# Altium project Dozimetr v1.0.PrjPcb
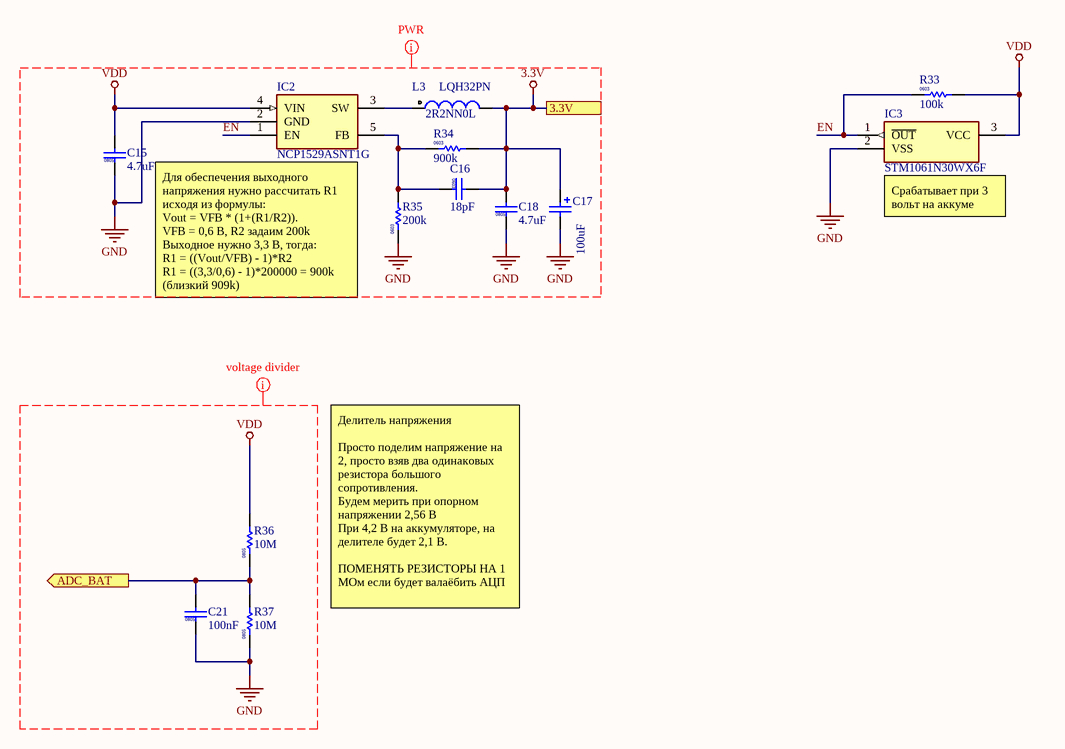
[diagram p0: Power.SchDoc]
1 sheet, 13 parts. Net scope: flat (ports and power ports of the same name join across sheets).
Board file: PCB_Dozimeter.PcbDoc

## Sheet Power.SchDoc
size A4

### Parts
C15  value 4.7uF  [CAPC2012-0805M]  (hidden comment: CAPC_0805)
C16  value 18pF  [CAPC1608-0603M]  (hidden comment: CAPC_0603)
C17  value 100uF  [ECAPC_0505]  (hidden comment: ECAPC_0505)
C18  value 4.7uF  [CAPC2012-0805M]  (hidden comment: CAPC_0805)
C21  value 100nF  [CAPC2012-0805M]  (hidden comment: CAPC_0805)
IC2  NCP1529ASNT1G  [SOT95P275X110-5N]
IC3  STM1061N30WX6F  [SOT103P237X112-3N]
L3  LQH32PN  value 2R2NN0L  [LQH32PN_M]
R33  value 100k  [RESC1608-0603M]  (hidden comment: RESC_0603)
R34  value 900k  [RESC1608-0603M]  (hidden comment: RESC_0603)
R35  value 200k  [RESC1608-0603M]  (hidden comment: RESC_0603)
R36  value 10M  [RESC2012-0805M]  (hidden comment: RESC_0805)
R37  value 10M  [RESC2012-0805M]  (hidden comment: RESC_0805)

### Ports
3.3V, ADC_BAT (out)

### Nets
3.3V: C16.2 C17.1 C18.2 L3.2 R34.2 ; port 3.3V
GND: C15.1 C17.2 C18.1 C21.1 IC2.2(GND) IC3.2(VSS) R35.1 R37.1
VDD: C15.2 IC2.4(VIN) IC3.3(VCC) R33.2 R36.2
EN: IC2.1(EN) IC3.1(~{OUT}) R33.1
NetC16_1: C16.1 IC2.5(FB) R34.1 R35.2
NetC21_2: C21.2 R36.1 R37.2 ; port ADC_BAT
NetIC2_3: IC2.3(SW) L3.1

### Layout directives
mark named voltage divider: GND, VDD
mark named PWR: 3.3V, EN, GND, VDD

### Notes on the sheet
- (near IC3) Срабатывает при 3 вольт на аккуме
- Для обеспечения выходного напряжения нужно рассчитать R1 исходя из формулы:
  Vout = VFB * (1+(R1/R2)).
  VFB = 0,6 В, R2 задаим 200k
  Выходное нужно 3,3 В, тогда:
  R1 = ((Vout/VFB) - 1)*R2
  R1 = ((3,3/0,6) - 1)*200000 = 900k (близкий 909k)
- Делитель напряжения
  Просто поделим напряжение на 2, просто взяв два одинаковых резистора большого сопротивления.
  Будем мерить при опорном напряжении 2,56 В
  При 4,2 В на аккумуляторе, на делителе будет 2,1 В.
  ПОМЕНЯТЬ РЕЗИСТОРЫ НА 1 МОм если будет валаёбить АЦП
- (in symbol CAPC_0603) 0603
- (in symbol CAPC_0805) 0805
- (in symbol RESC_0603) 0603
- (in symbol RESC_0805) 0805

### Library data of the parts
C15 C18 C21 = CAPC_0805: Capacitor 0805
C16 = CAPC_0603: Capacitor 0603
C17 = ECAPC_0505: Electrolytic Capacitor SMD 0505; Published: 8-Jun-2000; LatestRevisionDate: 17-Jul-2002; LatestRevisionNote: Re-released for DXP Platform.; PackageReference: C0805; Publisher: Altium Limited
IC2 = NCP1529ASNT1G: Integrated Circuit; Manufacturer_Name: ON Semiconductor; Allied_Number: 70466941; Datasheet Link: http://www.onsemi.com/pub/Collateral/NCP1529-D.PDF; Height: 1.1mm; Manufacturer_Part_Number: NCP1529ASNT1G; Mouser Part Number: 863-NCP1529ASNT1G; Mouser Price/Stock: https://www.mouser.com/Search/Refine.aspx?Keyword=863-NCP1529ASNT1G; RS Part Number: 8023161P; RS Price/Stock: http://uk.rs-online.com/web/p/products/8023161P; Allied Price/Stock: http://www.alliedelec.com/on-semiconductor-ncp1529asnt1g/70466941/
IC3 = STM1061N34WX6F: Integrated Circuit; Manufacturer_Name: STMicroelectronics; Allied_Number: 70014045; Datasheet Link: http://www.st.com/web/en/resource/technical/document/datasheet/CD00065467.pdf; Height: 1.12mm; Manufacturer_Part_Number: STM1061N34WX6F; Mouser Part Number: 511-STM1061N34WX6F; Mouser Price/Stock: https://www.mouser.com/Search/Refine.aspx?Keyword=511-STM1061N34WX6F; RS Part Number: 6864784; RS Price/Stock: https://uk.rs-online.com/web/p/products/6864784; Allied Price/Stock: http://www.alliedelec.com/stmicroelectronics-stm1061n34wx6f/70014045/
L3 = LQH32PN: LQH32PN Murata inductor; Code_IEC: 1005; Published: 8-Jun-2000; LatestRevisionDate: 17-Jul-2002; LatestRevisionNote: Re-released for DXP Platform.; PackageReference: 0402-A; Publisher: Altium Limited; Code_JEITA: 0402
R33-R35 = RESC_0603: Resistor 0603
R36 R37 = RESC_0805: Resistor 0805